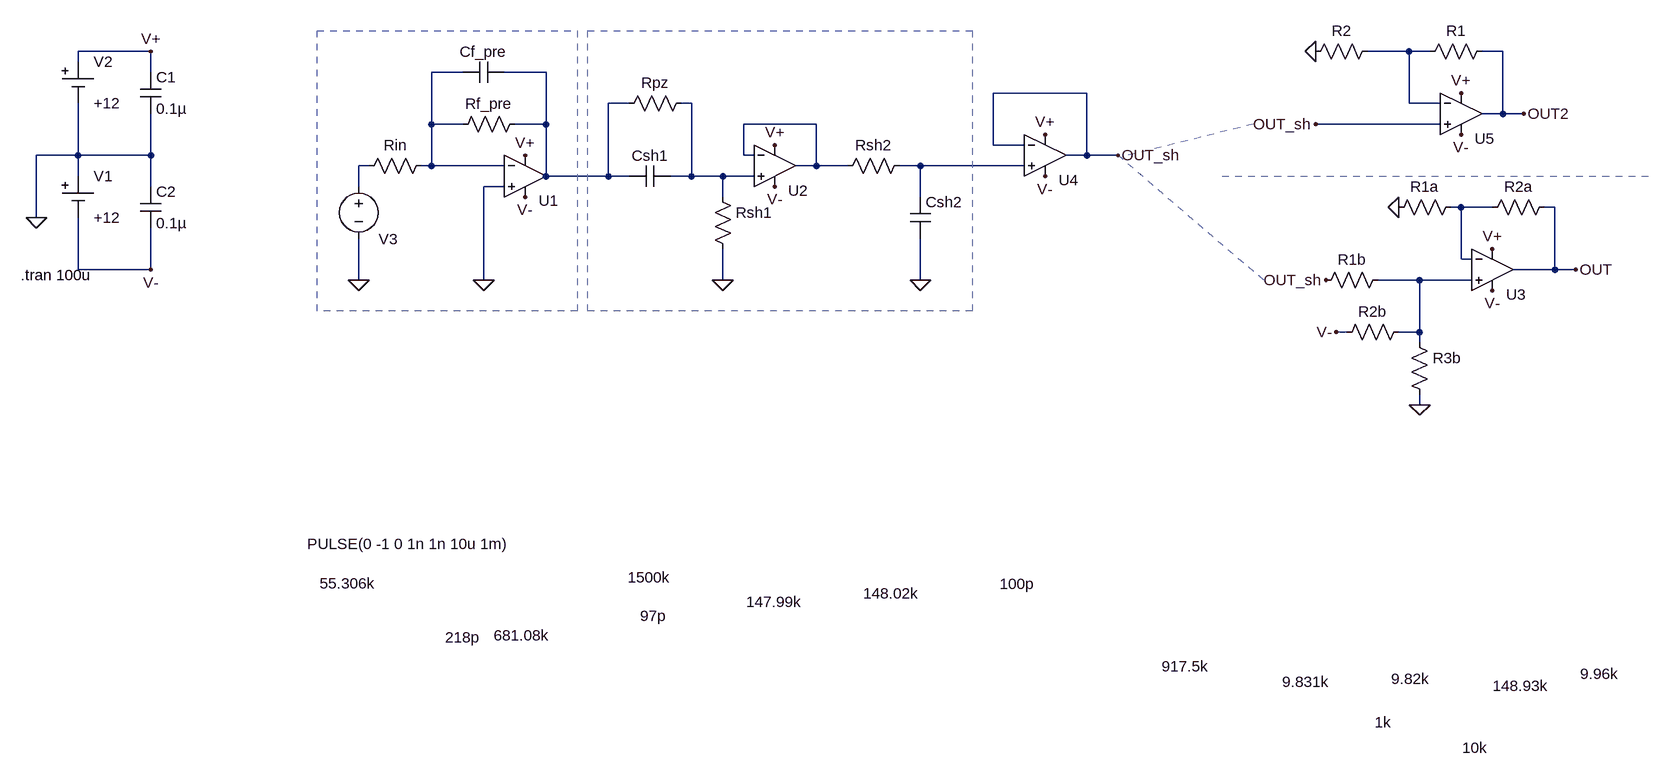
[diagram p0: schematic Circ_6.asc]
Circ_6.asc, the LTspice schematic file:
Version 4
SHEET 1 2336 1360
WIRE -720 -368 -832 -368
WIRE 1216 -368 1152 -368
WIRE 1248 -368 1216 -368
WIRE 1360 -368 1328 -368
WIRE -832 -352 -832 -368
WIRE -720 -336 -720 -368
WIRE -240 -336 -288 -336
WIRE -112 -336 -176 -336
WIRE 720 -304 576 -304
WIRE 16 -288 -16 -288
WIRE 112 -288 96 -288
WIRE 1216 -288 1216 -368
WIRE 1264 -288 1216 -288
WIRE 1360 -272 1360 -368
WIRE 1360 -272 1328 -272
WIRE 1392 -272 1360 -272
WIRE -288 -256 -288 -336
WIRE -240 -256 -288 -256
WIRE -112 -256 -112 -336
WIRE -112 -256 -160 -256
WIRE 304 -256 192 -256
WIRE 1264 -256 1072 -256
WIRE 576 -224 576 -304
WIRE 624 -224 576 -224
WIRE -832 -208 -832 -288
WIRE -832 -208 -896 -208
WIRE -720 -208 -720 -272
WIRE -720 -208 -832 -208
WIRE 192 -208 192 -256
WIRE 208 -208 192 -208
WIRE 720 -208 720 -304
WIRE 720 -208 688 -208
WIRE 768 -208 720 -208
WIRE -384 -192 -400 -192
WIRE -288 -192 -288 -256
WIRE -288 -192 -304 -192
WIRE -176 -192 -288 -192
WIRE 304 -192 304 -256
WIRE 304 -192 272 -192
WIRE 352 -192 304 -192
WIRE 464 -192 432 -192
WIRE 624 -192 464 -192
WIRE -832 -176 -832 -208
WIRE -112 -176 -112 -256
WIRE -16 -176 -16 -288
WIRE -16 -176 -112 -176
WIRE 16 -176 -16 -176
WIRE 112 -176 112 -288
WIRE 112 -176 80 -176
WIRE 160 -176 112 -176
WIRE 208 -176 160 -176
WIRE -720 -160 -720 -208
WIRE -400 -160 -400 -192
WIRE -176 -160 -208 -160
WIRE 160 -144 160 -176
WIRE 464 -144 464 -192
WIRE 1296 -128 1280 -128
WIRE 1344 -128 1296 -128
WIRE 1440 -128 1424 -128
WIRE -896 -112 -896 -208
WIRE 1296 -48 1296 -128
WIRE 1312 -48 1296 -48
WIRE -832 -32 -832 -112
WIRE -720 -32 -720 -96
WIRE -720 -32 -832 -32
WIRE 1440 -32 1440 -128
WIRE 1440 -32 1376 -32
WIRE 1472 -32 1440 -32
WIRE -400 -16 -400 -80
WIRE -208 -16 -208 -160
WIRE 160 -16 160 -64
WIRE 464 -16 464 -80
WIRE 1232 -16 1168 -16
WIRE 1312 -16 1232 -16
WIRE 1120 64 1104 64
WIRE 1232 64 1232 -16
WIRE 1232 64 1200 64
WIRE 1232 80 1232 64
WIRE 1232 176 1232 160
FLAG -896 -112 0
FLAG 160 -16 0
FLAG 464 -16 0
FLAG -400 -16 0
FLAG -208 -16 0
FLAG 1200 -128 0
FLAG 1232 176 0
FLAG 1472 -32 OUT
FLAG 1104 64 V-
FLAG -720 -32 V-
FLAG 1344 0 V-
FLAG 656 -176 V-
FLAG 240 -160 V-
FLAG -144 -144 V-
FLAG -720 -368 V+
FLAG -144 -208 V+
FLAG 240 -224 V+
FLAG 656 -240 V+
FLAG 1344 -64 V+
FLAG 1072 -368 0
FLAG 1296 -240 V-
FLAG 1296 -304 V+
FLAG 1392 -272 OUT2
FLAG 768 -208 OUT_sh
FLAG 1088 -16 OUT_sh
FLAG 1072 -256 OUT_sh
SYMBOL cap -736 -160 R0
SYMATTR InstName C2
SYMATTR Value 0.1µ
SYMBOL Misc\\cell -832 -176 R0
WINDOW 123 0 0 Left 0
WINDOW 39 0 0 Left 0
SYMATTR InstName V1
SYMATTR Value +12
SYMBOL Misc\\cell -832 -352 R0
WINDOW 123 0 0 Left 0
WINDOW 39 0 0 Left 0
SYMATTR InstName V2
SYMATTR Value +12
SYMBOL cap -736 -336 R0
SYMATTR InstName C1
SYMATTR Value 0.1µ
SYMBOL Opamps/UniversalOpamp2 240 -192 R0
WINDOW 0 21 38 Left 2
SYMATTR InstName U2
SYMBOL cap 80 -192 R90
WINDOW 0 0 32 VBottom 2
WINDOW 3 677 27 VTop 2
SYMATTR InstName Csh1
SYMATTR Value 97p
SYMBOL res 144 -160 R0
WINDOW 3 52 639 Left 2
SYMATTR Value 147.99k
SYMATTR InstName Rsh1
SYMBOL res 448 -208 R90
WINDOW 0 0 56 VBottom 2
WINDOW 3 659 29 VTop 2
SYMATTR InstName Rsh2
SYMATTR Value 148.02k
SYMBOL cap 448 -144 R0
WINDOW 3 138 596 Left 2
SYMATTR Value 100p
SYMATTR InstName Csh2
SYMBOL Opamps/UniversalOpamp2 -144 -176 R0
WINDOW 0 21 38 Left 2
SYMATTR InstName U1
SYMBOL res -144 -272 R90
WINDOW 0 0 56 VBottom 2
WINDOW 3 787 5 VTop 2
SYMATTR InstName Rf_pre
SYMATTR Value 681.08k
SYMBOL cap -176 -352 R90
WINDOW 0 0 32 VBottom 2
WINDOW 3 870 64 VTop 2
SYMATTR InstName Cf_pre
SYMATTR Value 218p
SYMBOL res -288 -208 R90
WINDOW 0 0 56 VBottom 2
WINDOW 3 643 129 VTop 2
SYMATTR InstName Rin
SYMATTR Value 55.306k
SYMBOL voltage -400 -176 R0
WINDOW 123 24 44 Left 2
WINDOW 39 0 0 Left 0
WINDOW 0 31 97 Left 2
WINDOW 3 -79 566 Left 2
SYMATTR InstName V3
SYMATTR Value PULSE(0 -1 0 1n 1n 10u 1m)
SYMBOL res 112 -304 R90
WINDOW 0 0 56 VBottom 2
WINDOW 3 730 65 VTop 2
SYMATTR InstName Rpz
SYMATTR Value 1500k
SYMBOL Opamps/UniversalOpamp2 656 -208 R0
WINDOW 0 21 38 Left 2
SYMATTR InstName U4
SYMBOL res 1440 -144 R90
WINDOW 0 0 56 VBottom 2
WINDOW 3 737 52 VTop 2
SYMATTR InstName R2a
SYMATTR Value 148.93k
SYMBOL res 1296 -144 R90
WINDOW 0 0 56 VBottom 2
WINDOW 3 726 78 VTop 2
SYMATTR InstName R1a
SYMATTR Value 9.82k
SYMBOL res 1184 -32 R90
WINDOW 0 0 56 VBottom 2
WINDOW 3 619 127 VTop 2
SYMATTR InstName R1b
SYMATTR Value 9.831k
SYMBOL res 1216 64 R0
WINDOW 3 263 526 Left 2
SYMATTR Value 9.96k
SYMATTR InstName R3b
SYMBOL res 1216 48 R90
WINDOW 0 0 56 VBottom 2
WINDOW 3 515 344 VTop 2
SYMATTR InstName R2b
SYMATTR Value 917.5k
SYMBOL Opamps/UniversalOpamp2 1344 -32 R0
WINDOW 0 21 38 Left 2
SYMATTR InstName U3
SYMBOL Opamps/UniversalOpamp2 1296 -272 R0
WINDOW 0 21 38 Left 2
SYMATTR InstName U5
SYMBOL res 1344 -384 R90
WINDOW 0 0 56 VBottom 2
WINDOW 3 1072 27 VTop 2
SYMATTR InstName R1
SYMATTR Value 10k
SYMBOL res 1168 -384 R90
WINDOW 0 0 56 VBottom 2
WINDOW 3 1033 -8 VTop 2
SYMATTR InstName R2
SYMATTR Value 1k
TEXT -920 -24 Left 2 !.tran 100u
LINE Normal 992 -16 768 -208 1
LINE Normal 928 -176 1584 -176 1
LINE Normal 976 -256 784 -208 1
RECTANGLE Normal -64 32 -464 -400 2
RECTANGLE Normal 544 32 -48 -400 2

The netlist it stands for:
* Circ_6.asc
C2 0 V- 0.1µ
V1 0 V- +12
V2 V+ 0 +12
C1 V+ 0 0.1µ
XU2 N004 N005 V+ V- N005 level.2 Avol=1Meg GBW=10Meg Slew=10Meg ilimit=25m rail=0 Vos=0 phimargin=45 en=0 enk=0 in=0 ink=0 Rin=500Meg  ; pins IN+ IN- V+ V- OUT
Csh1 N004 N003 97p
Rsh1 N004 0 147.99k
Rsh2 N007 N005 148.02k
Csh2 N007 0 100p
XU1 0 N002 V+ V- N003 level.2 Avol=1Meg GBW=10Meg Slew=10Meg ilimit=25m rail=0 Vos=0 phimargin=45 en=0 enk=0 in=0 ink=0 Rin=500Meg  ; pins IN+ IN- V+ V- OUT
Rf_pre N003 N002 681.08k
Cf_pre N003 N002 218p
Rin N002 N006 55.306k
V3 N006 0 PULSE(0 -1 0 1n 1n 10u 1m)
Rpz N004 N003 1500k
XU4 N007 OUT_sh V+ V- OUT_sh level.2 Avol=1Meg GBW=10Meg Slew=10Meg ilimit=25m rail=0 Vos=0 phimargin=45 en=0 enk=0 in=0 ink=0 Rin=500Meg  ; pins IN+ IN- V+ V- OUT
R2a OUT N008 148.93k
R1a N008 0 9.82k
R1b N009 OUT_sh 9.831k
R3b N009 0 9.96k
R2b N009 V- 917.5k
XU3 N009 N008 V+ V- OUT level.2 Avol=1Meg GBW=10Meg Slew=10Meg ilimit=25m rail=0 Vos=0 phimargin=45 en=0 enk=0 in=0 ink=0 Rin=500Meg  ; pins IN+ IN- V+ V- OUT
XU5 OUT_sh N001 V+ V- OUT2 level.2 Avol=1Meg GBW=10Meg Slew=10Meg ilimit=25m rail=0 Vos=0 phimargin=45 en=0 enk=0 in=0 ink=0 Rin=500Meg  ; pins IN+ IN- V+ V- OUT
R1 OUT2 N001 10k
R2 N001 0 1k
.tran 100u
.lib UniversalOpamps2.sub
.backanno
.end